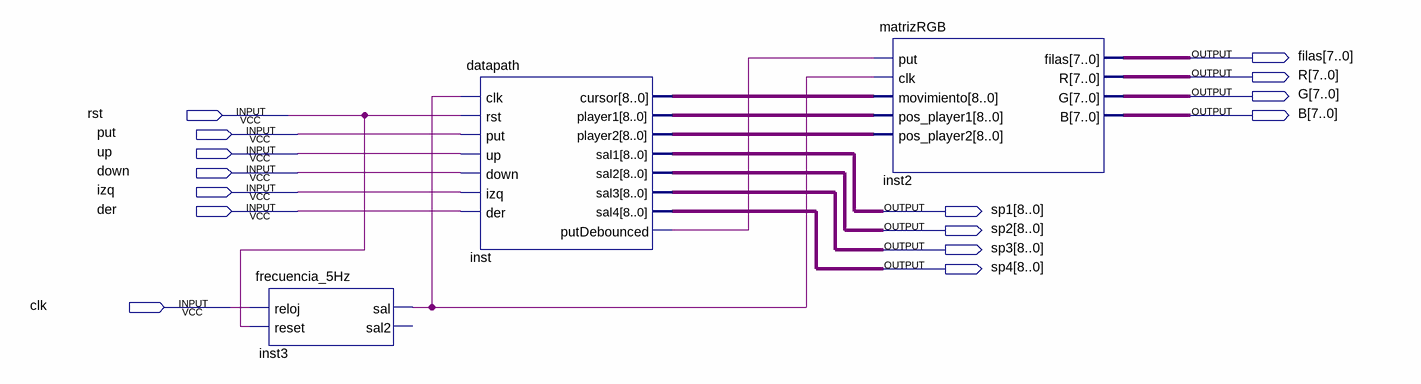
[diagram p0: schematic sheet]
// Quartus schematic final.bdf as structural Verilog: 3 symbols, 15 pins
module \final  (
  input  rst,
  input  put,
  input  up,
  input  down,
  input  izq,
  input  der,
  input  clk,
  output [7:0] filas,
  output [7:0] R,
  output [7:0] G,
  output [7:0] B,
  output [8:0] sp1,
  output [8:0] sp2,
  output [8:0] sp3,
  output [8:0] sp4
);

  wire inst3_sal, inst_putdebounced;
  wire [8:0] inst_cursor, inst_player1, inst_player2;

  frecuencia_5Hz inst3 (.reloj(clk), .reset(rst), .sal(inst3_sal));  // open: sal2
  datapath inst (
    .clk(inst3_sal), .rst(rst), .put(put), .up(up), .down(down), .izq(izq), .der(der), .cursor(inst_cursor),
    .player1(inst_player1), .player2(inst_player2), .sal1(sp1), .sal2(sp2), .sal3(sp3), .sal4(sp4),
    .putDebounced(inst_putdebounced));
  matrizRGB inst2 (
    .put(inst_putdebounced), .clk(inst3_sal), .movimiento(inst_cursor), .pos_player1(inst_player1),
    .pos_player2(inst_player2), .filas(filas), .R(R), .G(G), .B(B));
endmodule
